# EAGLE design MouseBox_PortBreakout_r1 (EAGLE 6.3)
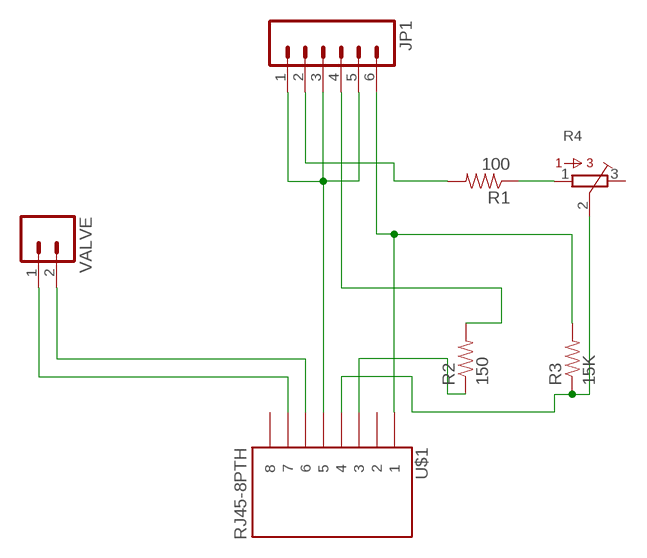
[diagram p0: schematic, sheet 1]

## Parts
JP1  M063.5MM-6  [SCREWTERMINAL-3.5MM-6]
R1  100  RESISTORAXIAL-0.3  [AXIAL-0.3]
R2  150  RESISTORAXIAL-0.3  [AXIAL-0.3]
R3  15K  RESISTORAXIAL-0.3  [AXIAL-0.3]
R4  3362R  [3362R]
U$1  RJ45-8PTH  [RJ45-8]
VALVE  M023.5MM_LOCK  [SCREWTERMINAL-3.5MM-2_LOCK]

## Nets
GND: JP1.1 JP1.3 JP1.5 U$1.5
N$1: JP1.6 R3.P$2 U$1.1
N$2: R3.P$1 R4.2 U$1.4
N$3: JP1.2 R1.P$2
N$5: U$1.6 VALVE.2
N$6: U$1.7 VALVE.1
N$7: JP1.4 R2.P$2
N$8: R2.P$1 U$1.3
N$9: R1.P$1 R4.1
Unconnected: R4.3 U$1.2 U$1.8

## Library data of the parts
JP1 = SparkFun:M06: Header 6 Standard 6-pin 0.1" header. Use with straight break away headers (SKU : PRT-00116), right angle break away headers (PRT-00553), swiss pins (PRT-00743), machine pins (PRT-00117), and female headers (PRT-00115). Molex polarized connector foot print use with SKU : PRT-08094 with associated crimp pins and housings. NOTES ON THE VARIANTS LOCK and LOCK_LONGPADS... This footprint was designed to help hold the alignment of a through-hole component (i.e. 6-pin header) while soldering it into place. You may notice that each hole has been shifted either up or down by 0.005 of an inch from it's more standard position (which is a perfectly straight line). This slight alteration caused the pins (the squares in the middle) to touch the edges of the holes. Because they are alternating, it causes a "brace" to hold the component in place. 0.005 has proven to be the perfect amount of "off-center" position when using our standard breakaway headers. Although looks a little odd when you look at the bare footprint, once you have a header in there, the alteration is very hard to notice. Also, if you push a header all the way into place, it is covered up entirely on the bottom side. This idea of altering the position of holes to aid alignment will be further integrated into the Sparkfun Library for other footprints. It can help hold any component with 3 or more connection pins.
R1-R3 = SparkFun-Resistors:RESISTOR: Resistor Basic schematic elements and footprints for 0603, 1206, and PTH resistors.
R4 = bourns:3362: 3362 Series 1/4" Square Trimmer
U$1 = SparkFun:RJ45-8: RJ45 Jack Simple RJ45, 8-pin connection - connector for common Cat5, Cat5e, and Cat6 Ethernet cables. Footprint not yet proven in production. Connector sku is PRT-00643; Breakout PCB sku is BOB-00716.
VALVE = SparkFun:M02: Header 2 Standard 2-pin 0.1" header. Use with straight break away headers (SKU : PRT-00116), right angle break away headers (PRT-00553), swiss pins (PRT-00743), machine pins (PRT-00117), and female headers (PRT-00115). Molex polarized connector foot print use with SKU : PRT-08233 with associated crimp pins and housings.

## Board
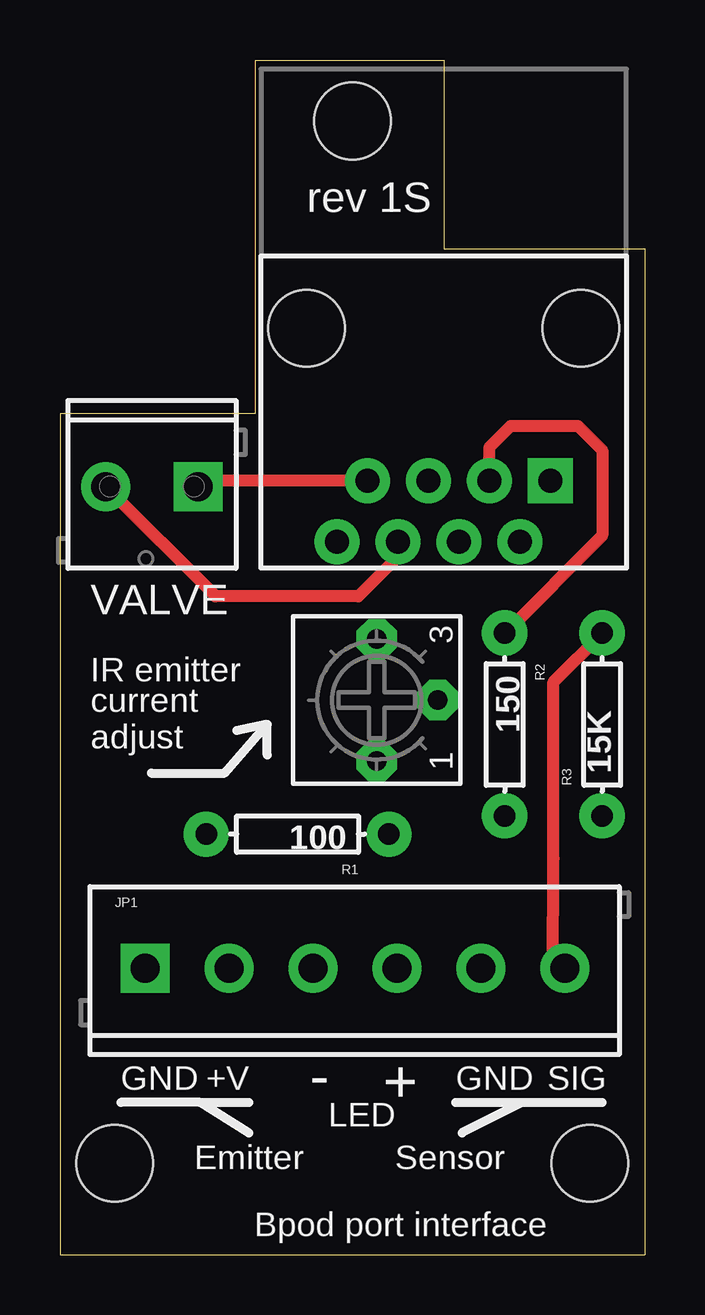
[diagram p1: board, top side]
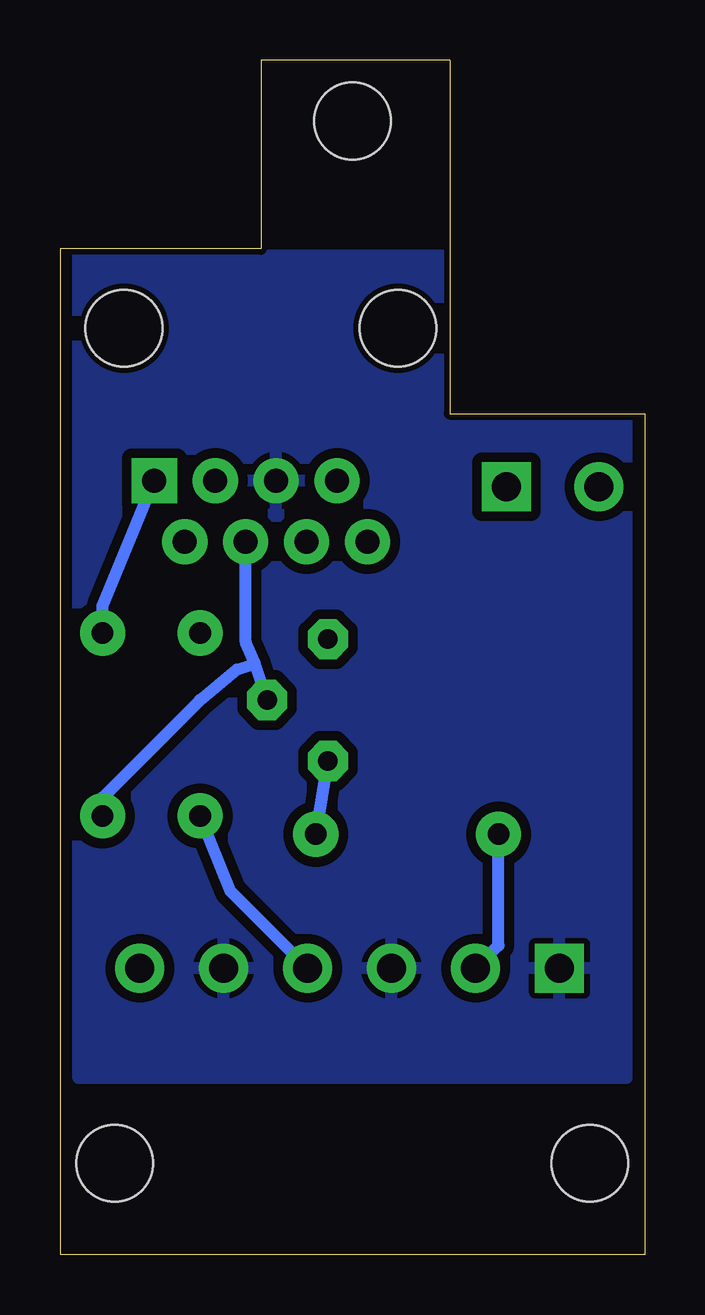
[diagram p2: board, bottom side, seen from below]

Size 24.38 x 49.78 mm. Coordinates in mm from the lower left corner, seen from the top.
Outline: 0,0 24.38,0 24.38,41.91 16,41.91 16,49.78 8.13,49.78 8.13,35.05 0,35.05 0,0
Copper layers (1*16): Top 0.035mm / dielectric 1.5mm / Bottom 0.035mm
Design rules "SeeedStudio_2layer_DRU_no_angle_20140221 *": minimum track width 6mil, minimum drill 12mil, track to track 16mil, track to pad 16mil, pad to pad 6mil, via to via 6mil, smd to smd 0mil, copper to edge 10mil, drill to drill 10mil, minimum pad ring 10mil, minimum via ring 6mil, stop-mask expansion 2mil, vias tented up to drill 100mil, thermal gap 10mil
Holes 3.2 mm at 12.19,47.24 22.1,3.81 2.29,3.81

### Footprints (pad centres in the part's own frame; a part is rotated, then mirrored left to right if it is on the bottom)
SCREWTERMINAL-3.5MM-6 = drill 1.2 pad 2.032 square: 1 0,0 | drill 1.2 pad 2.032: 2 3.5,0; 3 7,0; 4 10.5,0; 5 14,0; 6 17.5,0
AXIAL-0.3 = drill 0.9 pad 1.88: P$1 -3.81,0; P$2 3.81,0
3362R = drill 0.813 pad 1.676 octagon: 1 -2.54,0; 2 0,-2.54; 3 2.54,0
RJ45-8 = drill 1 pad 1.88 square: 1 -4.445,6.35 | drill 1 pad 1.88: 2 -3.175,8.89; 3 -1.905,6.35; 4 -0.635,8.89; 5 0.635,6.35; 6 1.905,8.89; 7 3.175,6.35; 8 4.445,8.89 | hole 3.2: -5.715,0; 5.715,0
SCREWTERMINAL-3.5MM-2_LOCK = drill 1.2 pad 2.032 square: 1 -0.178,0 | drill 1.2 pad 2.032: 2 3.678,0

### Placement (x,y rotation side)
JP1  3.56,11.94 0 top
R1  9.91,17.53 180 top
R2  18.54,22.1 270 top
R3  22.61,22.1 90 top
R4  13.21,23.11 90 top
U$1  16,38.61 180 top
VALVE  5.59,32 180 top

### Tracks (layer width: path | path; a pad name or v marks a point on that pad's centre or on a via)
GND
  pour Bottom: 0.76,7.37 23.62,7.37 23.62,41.66 0.76,41.66
N$1
  Top 0.508: JP1.6 20.55,11.71 20.57,16.51 20.57,23.88 R3.P$2
  Bottom 0.508: R3.P$2 22.61,27.05 U$1.1
N$2
  Bottom 0.508: R4.2 16.26,24.64 | 16.26,24.64 16.64,25.53 U$1.4 | R3.P$1 22.61,19.05 18.54,23.11 17.02,24.38 16.26,24.64
N$3
  Bottom 0.508: JP1.2 6.1,12.9 R1.P$2
N$5
  Top 0.508: U$1.6 14.1,29.08 12.45,27.43 6.48,27.43 VALVE.2
N$6
  Top 0.508: U$1.7 5.77,32.26 VALVE.1
N$7
  Bottom 0.508: JP1.4 17.27,15.15 R2.P$2
N$8
  Top 0.508: U$1.3 17.91,33.66 18.8,34.54 21.59,34.54 22.61,33.53 22.61,29.97 R2.P$1
N$9
  Bottom 0.508: R1.P$1 R4.1

### Text on the board
tPlace: rev 1S | IR emitter | current | adjust | GND | +V | - | GND | SIG | + | LED | Emitter | Sensor | Bpod port interface